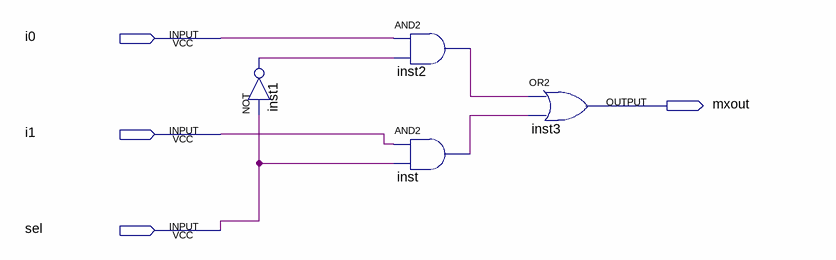
[diagram p0: schematic sheet]
// Quartus schematic _2to1mux.bdf as structural Verilog: 4 symbols, 4 pins
module _2to1mux (
  input  i0,
  input  i1,
  input  sel,
  output mxout
);

  wire inst1_out, inst2_out, inst_out;

  not inst1 (inst1_out, sel);
  and inst2 (inst2_out, i0, inst1_out);
  and inst (inst_out, i1, sel);
  or inst3 (mxout, inst2_out, inst_out);
endmodule
